# EAGLE design PiHome Temp Sensors (EAGLE 9.0.1)
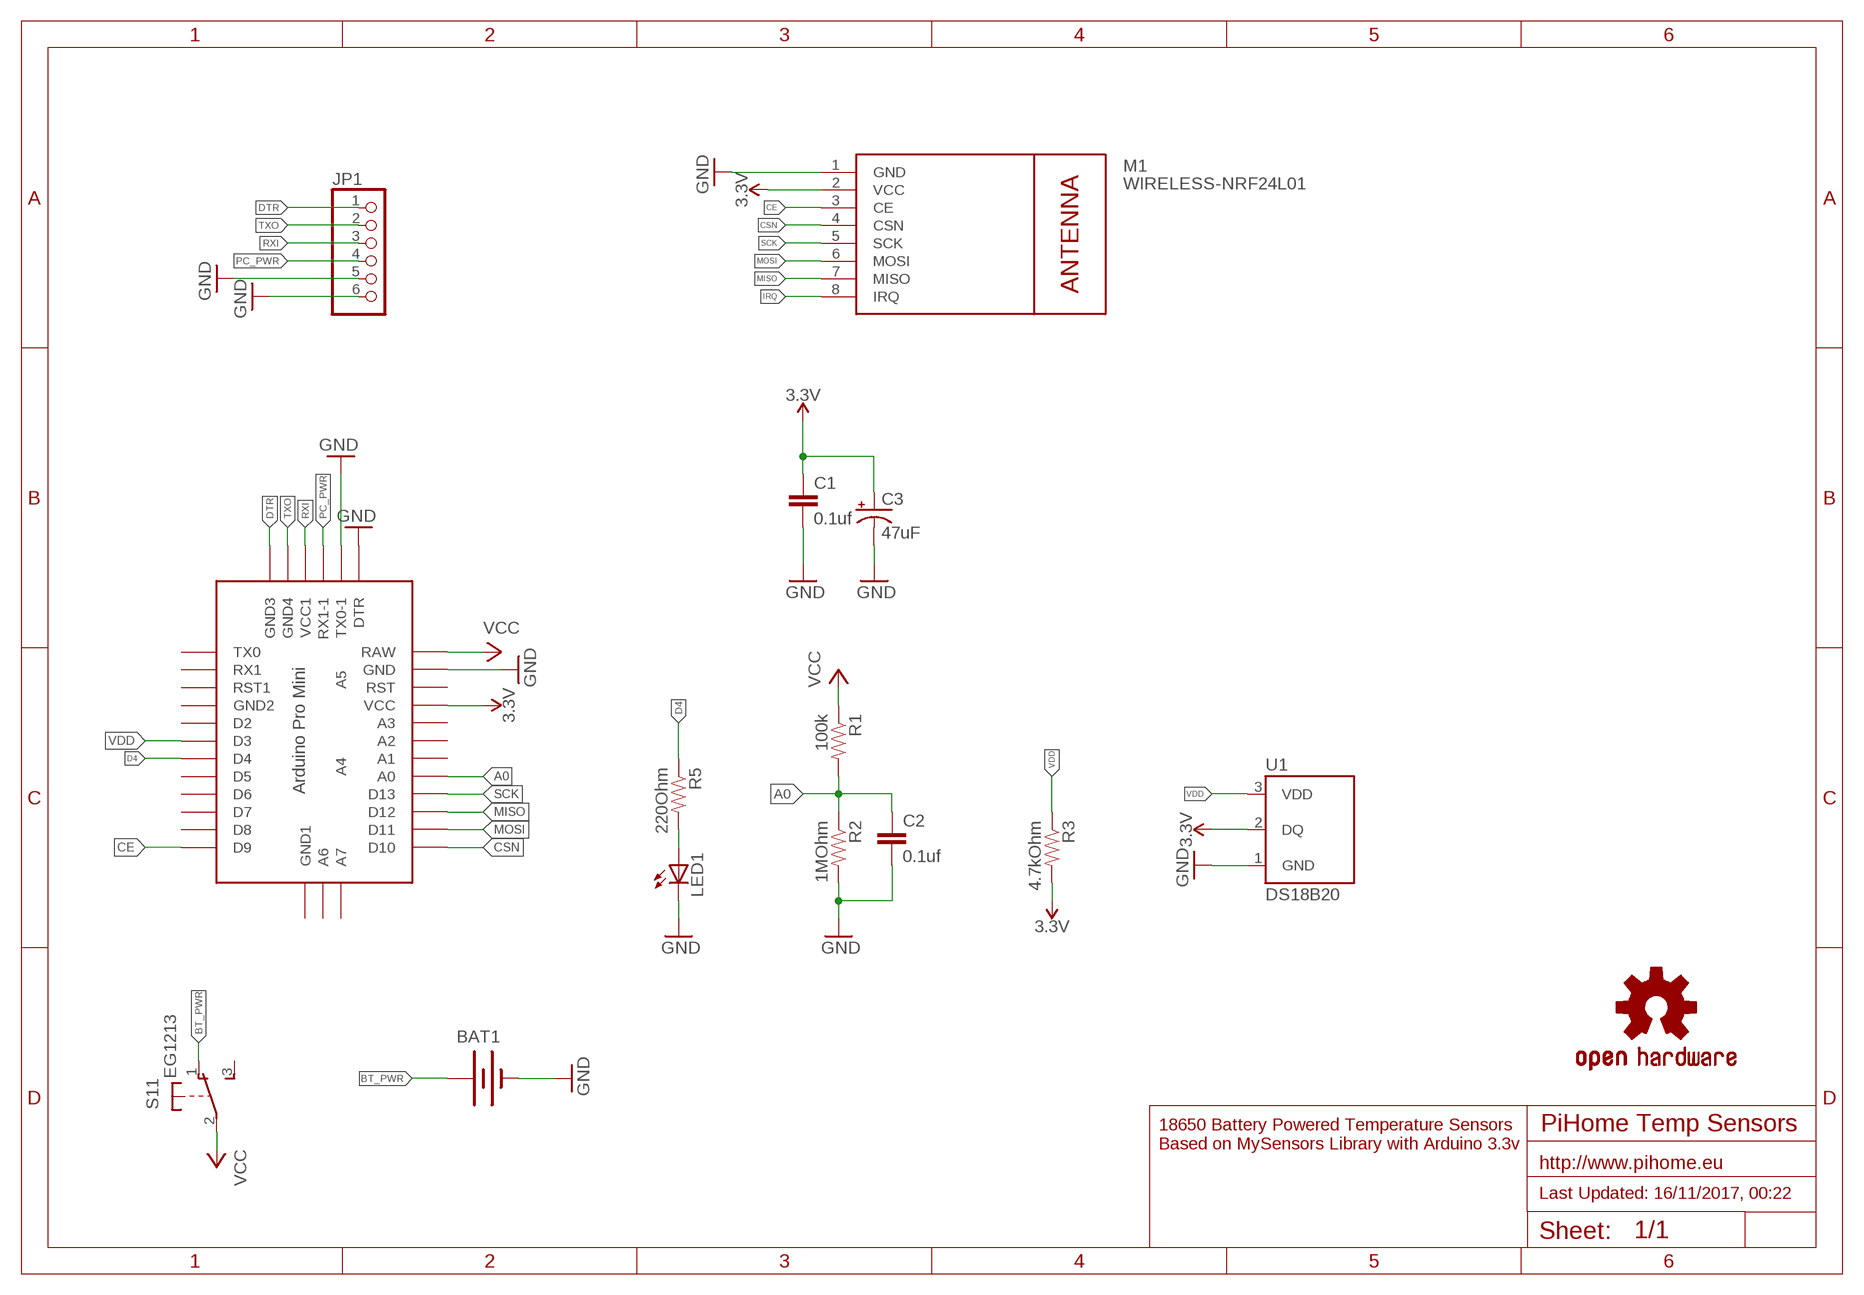
[diagram p0: schematic, sheet 1]

## Parts
BAT1  BATTERY18650  [BATTERY_18650-HOLDER]
C1  0.1uf  0.1UF-50V-20%(PTH)KIT-EZ  [CAP-PTH-SMALL-KIT]
C2  0.1uf  0.1UF-50V-20%(PTH)KIT-EZ  [CAP-PTH-SMALL-KIT]
C3  47uF  10UF-25V-20%(PTH)KIT  [CPOL-RADIAL-10UF-25V-KIT]
JP1  PINHD-1X6  [1X06]
LED1  LED3MM  [LED3MM]
LOGO1  OSHW-LOGOL  [OSHW-LOGO-L]
M1  WIRELESS-NRF24L01  [WIRELESS-NRF24L01]
R1  100k  100KOHM-1/4W-5%(PTH)  [AXIAL-0.3]
R2  1MOhm  RESISTORAXIAL-0.3  [AXIAL-0.3]
R3  4.7kOhm  RESISTORAXIAL-0.3  [AXIAL-0.3]
R5  220Ohm  RESISTORAXIAL-0.3  [AXIAL-0.3]
S1  EG1213  [EG1213]
U1  DS18B20  [TO-92-AMMO]
U$1  ABK-PRO-MINI  [ABK-PRO-MINI]

## Nets
3.3V: C1.1 C3.1(+) M1.2(VCC) R3.P$2 U1.2(DQ) U$1.VCC
A0: C2.1 R1.P$2 R2.P$1 U$1.A0
BT_PWR: BAT1.PWR@1(+) S1.1(1:O)
CE: M1.3(CE) U$1.D9
CSN: M1.4(CSN) U$1.D10
D4: R5.P$1 U$1.D4
DTR: JP1.1 U$1.GND2(GND3)
GND: BAT1.GND@1(-) C1.2 C2.2 C3.2(-) JP1.5 JP1.6 LED1.K(C) M1.1(GND) R2.P$2 U1.1(GND) U$1.DTR U$1.GND U$1.TX0-1
IRQ: M1.8(IRQ)
MISO: M1.7(MISO) U$1.D12
MOSI: M1.6(MOSI) U$1.D11
N$1: LED1.A R5.P$2
PC_PWR: JP1.4 U$1.RX1-1
RXI: JP1.3 U$1.VCC1
SCK: M1.5(SCK) U$1.D13
TXO: JP1.2 U$1.GND3(GND4)
VCC: R1.P$1 S1.2(1:P) U$1.RAW
VDD: R3.P$1 U1.3(VDD) U$1.D3
Unconnected: S1.3(1:S) S1.MT1(MT) S1.MT2(MT) U$1.A1 U$1.A2 U$1.A3 U$1.A4 U$1.A5 U$1.A6 U$1.A7 U$1.D2 U$1.D5 U$1.D6 U$1.D7 U$1.D8 U$1.GND1(GND2) U$1.GND4(GND1) U$1.RST U$1.RST1 U$1.RX1 U$1.TX0

## Notes on the sheet
- 18650 Battery Powered Temperature Sensors
  Based on MySensors Library with Arduino 3.3v
- http://www.pihome.eu
- Last Updated: 16/11/2017, 00:22

## Library data of the parts
BAT1 = SparkFun-Electromechanical:BATTERY: Battery Holders Various common sizes : AA, AAA, 18650 (PRT-12895), 20mm coin cell and 12mm coin cell. 20MM_4LEGS, BATT-10373
C1 C2 = SparkFun-Capacitors:0.1UF-50V-20%(PTH): CAP-08370; PROD_ID: CAP-08370
C3 = SparkFun-Capacitors:10UF-25V-20%(PTH): CAP-08440; PROD_ID: CAP-08440
JP1 = adafruit:PINHD-1X6: PIN HEADER
LED1 = adafruit:LED: LED OSRAM: - CHIPLED LG R971, LG N971, LY N971, LG Q971, LY Q971, LO R971, LY R971 LH N974, LH R974 LS Q976, LO Q976, LY Q976 LO Q996 - Hyper CHIPLED LW Q18S LB Q993, LB Q99A, LB R99A - SideLED LS A670, LO A670, LY A670, LG A670, LP A670 LB A673, LV A673, LT A673, LW A673 LH A674 LY A675 LS A676, LA A676, LO A676, LY A676, LW A676 LS A679, LY A679, LG A679 - Hyper Micro SIDELED® LS Y876, LA Y876, LO Y876, LY Y876 LT Y87S - SmartLED LW L88C, LW L88S LB L89C, LB L89S, LG L890 LS L89K, LO L89K, LY L89K LS L896, LA L896, LO L896, LY L896 - TOPLED LS T670, LO T670, LY T670, LG T670, LP T670 LSG T670, LSP T670, LSY T670, LOP T670, LYG T670 LG T671, LOG T671, LSG T671 LB T673, LV T673, LT T673, LW T673 LH T674 LS T676, LA T676, LO T676, LY T676, LB T676, LH T676, LSB T676, LW T676 LB T67C, LV T67C, LT T67C, LS T67K, LO T67K, LY T67K, LW E67C LS E67B, LA E67B, LO E67B, LY E67B, LB E67C, LV E67C, LT E67C LW T67C LS T679, LY T679, LG T679 LS T770, LO T770, LY T770, LG T770, LP T770 LB T773, LV T773, LT T773, LW T773 LH T774 LS E675, LA E675, LY E675, LS T675 LS T776, LA T776, LO T776, LY T776, LB T776 LHGB T686 LT T68C, LB T68C - Hyper Mini TOPLED® LB M676 - Mini TOPLED Santana® LG M470 LS M47K, LO M47K, LY M47K Source: http://www.osram.convergy.de/
LOGO1 = SparkFun-Aesthetics:OSHW-LOGO: Open Source Hardware Logo This logo indicates the piece of hardware it is found on incorporates a OSHW license and/or adheres to the definition of open source hardware found here: http://freedomdefined.org/OSHW
M1 = diy-modules:WIRELESS-NRF24L01: 2.4 GHz Wireless Module based on NRF24L01 chip More details available here: http://www.electrodragon.com/w/NRF24L01 Click here to find device on ebay.com <http://www.ebay.com/sch/nrf24l01+arduino>
R1 = SparkFun-Resistors:100KOHM-1/4W-5%(PTH): RES-10686; PROD_ID: RES-10686
R2 R3 R5 = SparkFun-Resistors:RESISTOR: Resistor Basic schematic elements and footprints for 0603, 1206, and PTH resistors.
S1 = adafruit:EG1213: E-Switch right-angle slide SPDT Part #EG1213 http://www.ladyada.net/library/eagle
U1 = SparkFun-Sensors:DS18B20: Dallas/Maxim DS18B20 1-wire temperature sensor Datasheet: http://datasheets.maximintegrated.com/en/ds/DS18B20.pdf temp thermometer 1-wire one-wire one wire; STORE_ID: SEN-00245
U$1 = Arduino Pro Mini-Nano:ABK-PRO-MINI: ABK Pro-Mini Arduino Clone

## Net classes
0 default: width 0.305 mm, drill 0.508 mm, clearance 0.254 mm

## Board
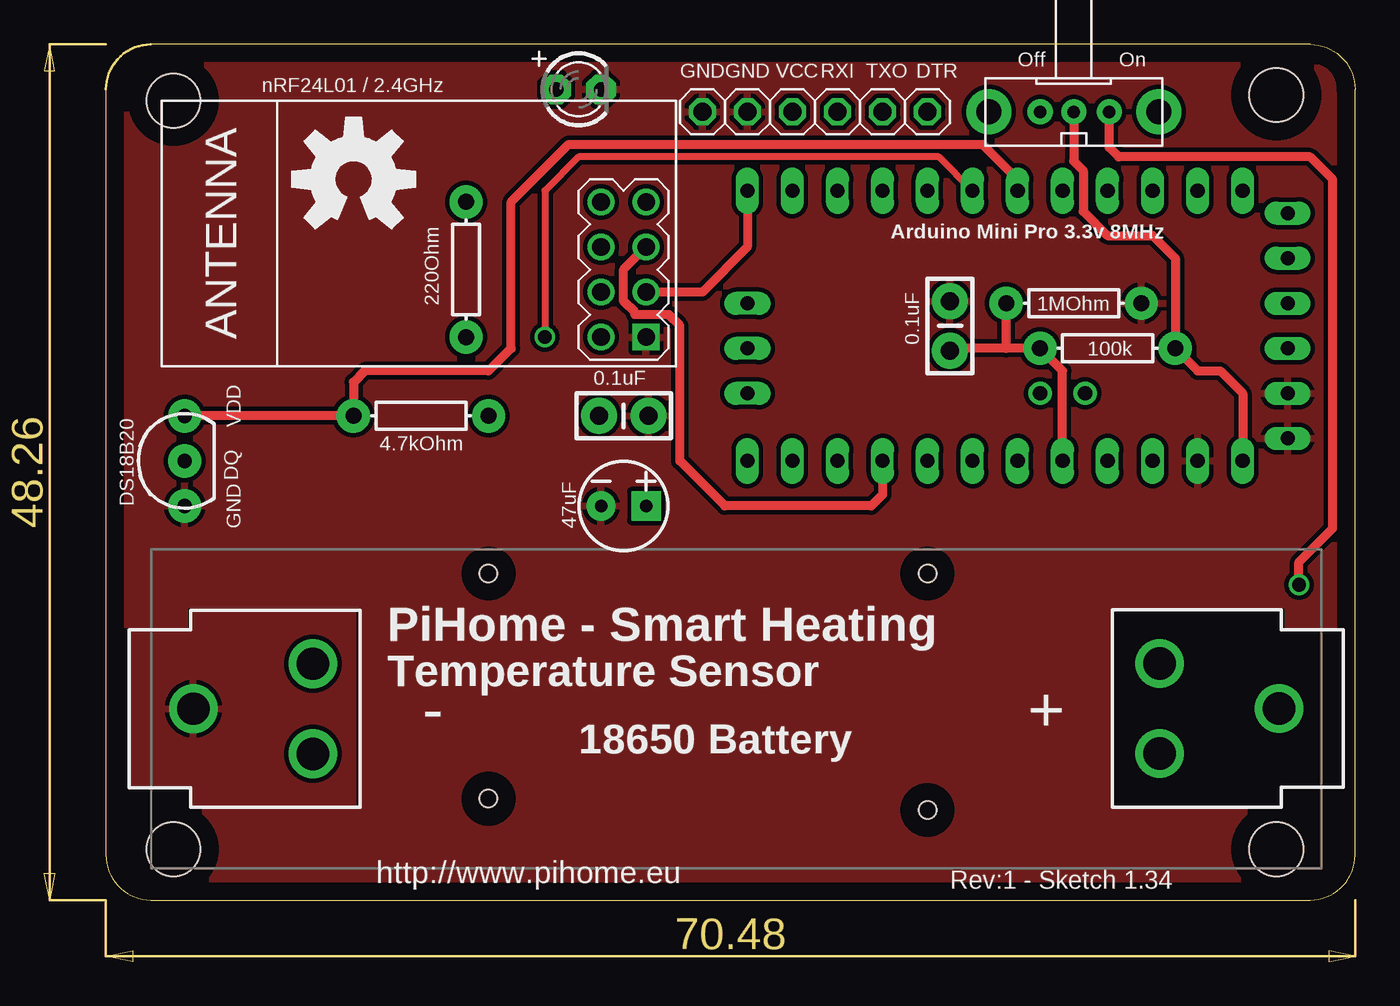
[diagram p1: board, top side]
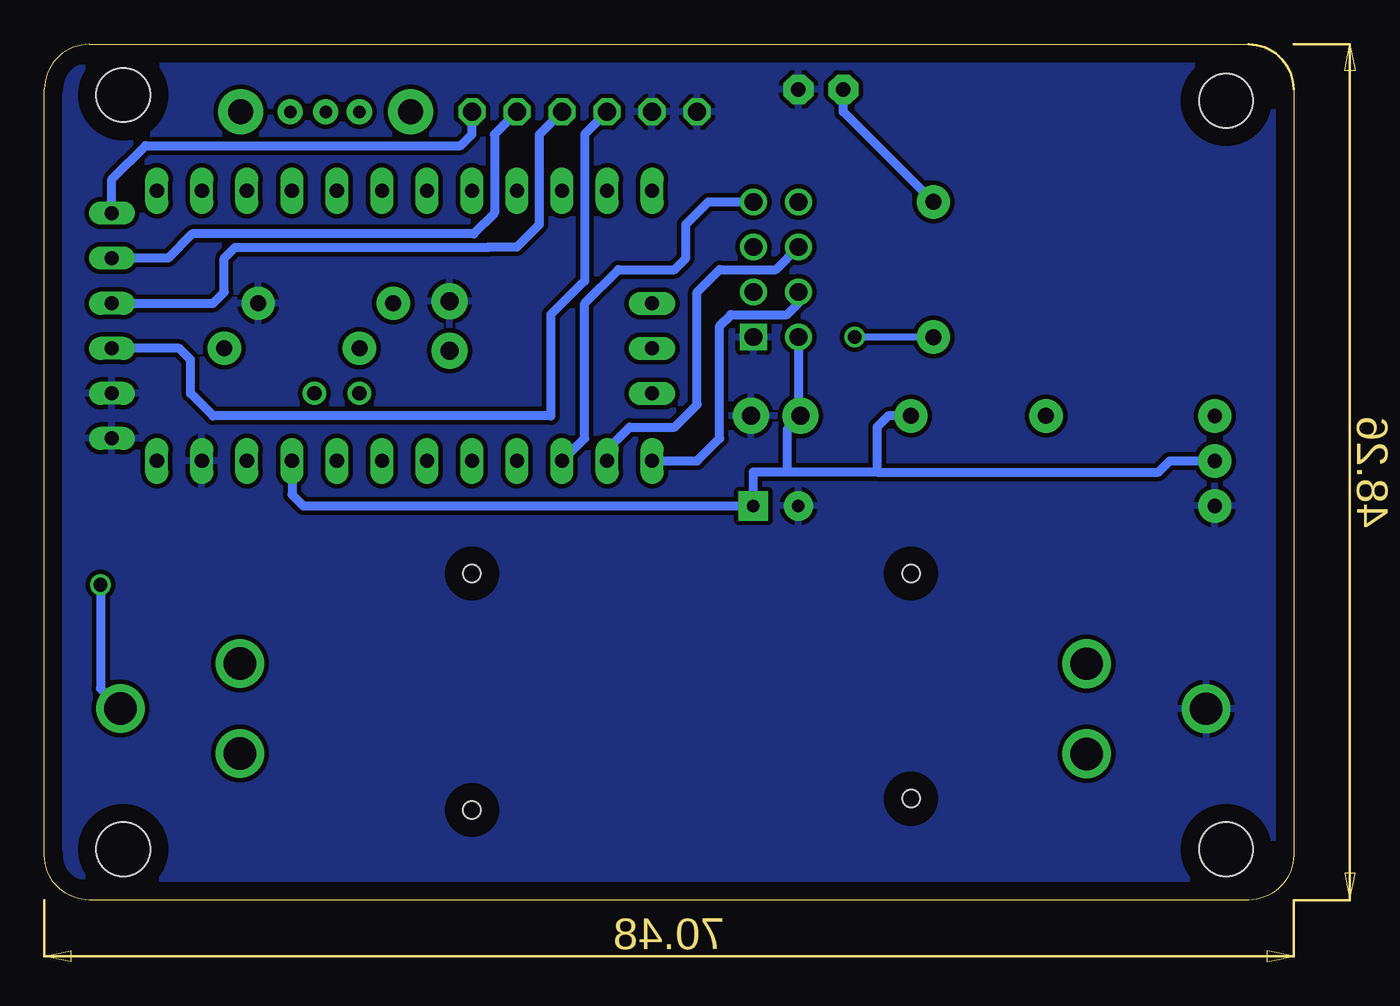
[diagram p2: board, bottom side, seen from below]

Size 70.48 x 48.26 mm. Coordinates in mm from the lower left corner, seen from the top.
Outline: 2.54,0 67.94,0 arc90 70.48,2.54 70.48,45.72 arc90 67.94,48.26 2.54,48.26 arc90 0,45.72 0,2.54 arc90 2.54,0
Copper layers (1*16): Top 0.035mm / dielectric 1.5mm / Bottom 0.035mm
Design rules "default": minimum track width 10mil, minimum drill 24mil, track to track 8mil, track to pad 8mil, pad to pad 8mil, via to via 8mil, smd to smd 8mil, copper to edge 40mil, drill to drill 8mil, minimum pad ring 10mil, minimum via ring 8mil, stop-mask expansion 4mil, vias tented up to drill 0mil, thermal gap 10mil
Holes 3.05 mm at 3.81,45.09 3.81,2.86 66.04,2.86 66.04,45.4
Holes 1 mm at 21.59,5.71 21.59,18.41 46.35,5.08 46.35,18.41

### Footprints (pad centres in the part's own frame; a part is rotated, then mirrored left to right if it is on the bottom)
BATTERY_18650-HOLDER = drill 1.829: GND@1 30.628,0.01; GND@2 23.88,2.55; GND@3 23.88,-2.53; PWR@1 -30.628,-0.01; PWR@2 -23.88,2.53; PWR@3 -23.88,-2.55
CAP-PTH-SMALL-KIT = drill 1.016 pad 2.032: 1 -1.397,0; 2 1.397,0
CPOL-RADIAL-10UF-25V-KIT = drill 0.7 pad 1.651 square: 1 1.27,0 | drill 0.7 pad 1.651: 2 -1.27,0
1X06 = drill 1.016 octagon: 1 -6.35,0; 2 -3.81,0; 3 -1.27,0; 4 1.27,0; 5 3.81,0; 6 6.35,0
LED3MM = drill 0.813 pad 1.676 octagon: A -1.27,0; K 1.27,0
WIRELESS-NRF24L01 = drill 1 square: 1 -12.7,6.35 | drill 1: 2 -10.16,6.35; 3 -12.7,3.81; 4 -10.16,3.81; 5 -12.7,1.27; 6 -10.16,1.27; 7 -12.7,-1.27; 8 -10.16,-1.27
AXIAL-0.3 = drill 0.9 pad 1.88: P$1 -3.81,0; P$2 3.81,0
EG1213 = drill 0.7 pad 1.422: 1 -2,0; 2 0,0; 3 1.9,0 | drill 1.4 pad 2.54: MT1 -4.8,0; MT2 4.8,0
TO-92-AMMO = drill 0.813 pad 1.88: 1 -2.54,0; 2 0,0; 3 2.54,0
ABK-PRO-MINI = drill 0.8 long: A0 10.16,-3.81; A1 10.16,-6.35; A2 10.16,-8.89; A3 10.16,-11.43; A6 3.81,-21.59; A7 6.35,-21.59; D2 -5.08,-3.81; D3 -5.08,-6.35; D4 -5.08,-8.89; D5 -5.08,-11.43; D6 -5.08,-13.97; D7 -5.08,-16.51; D8 -5.08,-19.05; D9 -5.08,-21.59; D10 10.16,-21.59; D11 10.16,-19.05; D12 10.16,-16.51; D13 10.16,-13.97; DTR 8.89,8.89; GND 10.16,3.81; GND1 -5.08,-1.27; GND2 -3.81,8.89; GND3 -1.27,8.89; GND4 1.27,-21.59; RAW 10.16,6.35; RST 10.16,1.27; RST1 -5.08,1.27; RX1 -5.08,3.81; RX1-1 3.81,8.89; TX0 -5.08,6.35; TX0-1 6.35,8.89; VCC 10.16,-1.27; VCC1 1.27,8.89 | drill 0.8: A4 6.35,-5.08; A5 6.35,-2.54

### Placement (x,y rotation side)
BAT1  35.56,10.79 180 top
C1  29.21,27.3 0 top
C2  47.62,32.39 90 top
C3  29.21,22.22 0 top
JP1  40.01,44.45 180 top
LED1  26.67,45.72 0 top
LOGO1  13.97,40.64 0 top
M1  17.78,38.1 180 top
R1  56.52,31.11 180 top
R2  54.61,33.66 0 top
R3  17.78,27.3 0 top
R5  20.32,35.56 90 top
S1  54.61,44.45 180 top
U1  4.45,24.76 90 top
U$1  57.78,34.93 270 top

### Tracks (layer width: path | path; a pad name or v marks a point on that pad's centre or on a via)
3.3V
  Bottom 0.508: U$1.VCC 56.52,22.86 55.88,22.22 34.92,22.22 C3.1 30.48,24.13 28.57,24.13 | 23.5,24.13 7.62,24.13 6.99,24.76 U1.2 | 23.5,24.13 28.57,24.13 | R3.P$2 22.86,27.3 23.5,26.67 23.5,24.13 | 28.57,24.13 28.57,26.54 C1.1 27.94,27.43 M1.2
A0
  Top 0.508: U$1.A0 53.98,29.84 R1.P$2 50.8,31.11 | 50.8,31.11 47.75,31.11 C2.1 | 50.8,31.11 R2.P$1
BT_PWR  (via drill 0.76)
  Top 0.508: v67.31,17.78 67.31,19.05 69.22,20.95 69.22,40.64 67.94,41.91 57.15,41.91 56.61,42.45 S1.1
  Bottom 0.508: BAT1.PWR@1 67.31,11.93 v67.31,17.78
CE
  Top 0.508: U$1.D9 36.2,36.83 33.66,34.29 M1.3
CSN
  Bottom 0.508: U$1.D10 33.66,24.76 32.38,26.04 32.38,32.39 31.75,33.02 28.57,33.02 27.94,33.66 M1.4
D4  (via drill 0.76)
  Top 0.406: U$1.D4 46.99,41.91 26.67,41.91 24.77,40.01 v24.77,31.75
  Bottom 0.406: R5.P$1 v24.77,31.75
DTR
  Bottom 0.508: U$1.GND2 66.67,40.64 64.77,42.55 46.99,42.55 46.35,43.18 JP1.1
GND
  pour Top: 0,48.26 70.48,48.26 70.48,0 0,0
  pour Bottom: 0,48.26 70.48,48.26 70.48,0 0,0
MISO
  Bottom 0.508: U$1.D12 40.01,26.04 40.01,33.66 38.1,35.56 34.92,35.56 34.29,36.2 34.29,38.1 33.02,39.37 M1.7
MOSI
  Bottom 0.508: U$1.D11 38.73,25.4 37.47,26.67 34.92,26.67 33.66,27.94 33.66,34.29 32.38,35.56 29.21,35.56 M1.6
N$1
  Bottom 0.508: R5.P$2 25.4,44.45 LED1.A
PC_PWR
  Bottom 0.508: JP1.4 40.01,43.18 40.01,34.93 41.91,33.02 41.91,27.3 60.96,27.3 62.23,28.57 62.23,30.48 62.87,31.11 U$1.RX1-1 67.31,31.11
RXI
  Bottom 0.508: U$1.VCC1 60.96,33.66 60.33,34.29 60.33,36.2 59.72,36.8 45.45,36.8 45.42,36.83 43.81,36.83 42.55,38.1 42.55,43.18 JP1.3
SCK
  Top 0.508: U$1.D13 43.81,22.86 43.18,22.22 34.92,22.22 32.38,24.76 32.38,32.39 31.75,33.02 29.84,33.02 29.84,33.14 29.22,33.77 29.22,35.57 M1.5
TXO
  Bottom 0.508: JP1.2 45.09,43.18 45.09,38.73 46.25,37.57 62.13,37.57 63.5,36.2 U$1.GND3
VCC
  Top 0.508: U$1.RAW 64.14,28.57 62.87,29.84 61.59,29.84 R1.P$1 60.33,36.2 59.05,37.47 56.52,37.47 55.14,38.84 55.14,41.14 54.61,41.67 S1.2
VDD
  Top 0.508: U1.3 R3.P$1 13.97,29.21 14.61,29.84 21.59,29.84 22.86,31.11 22.86,39.37 26.11,42.62 49.45,42.62 51.44,40.64 U$1.D3

### Text on the board
tPlace: Off | On | nRF24L01 / 2.4GHz | GND | GND | VCC | RXI | TXO | DTR | Arduino Mini Pro 3.3v 8MHz | 0.1uF | 0.1uF | VDD | DQ | DS18B20 | GND | Temperature Sensor | 18650 Battery | http://www.pihome.eu | Rev:1 - Sketch 1.34
tNames: PiHome - Smart Heating